# EAGLE schematic T01_Synth_Glove_v5_nsayre (EAGLE 7.1.0)
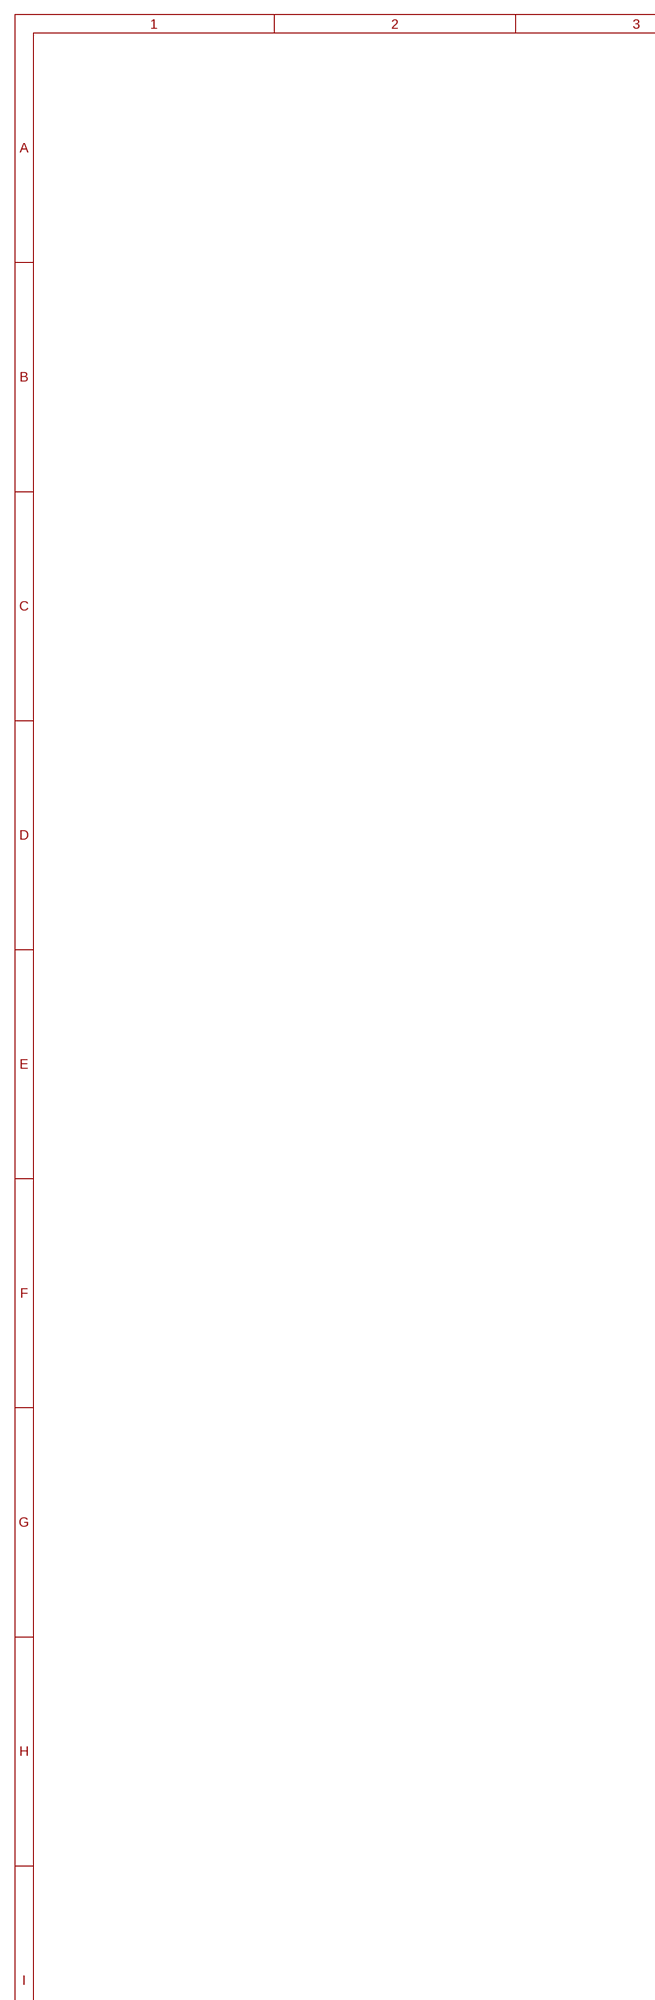
[diagram p0: schematic, sheet 1, part 1 of 2]
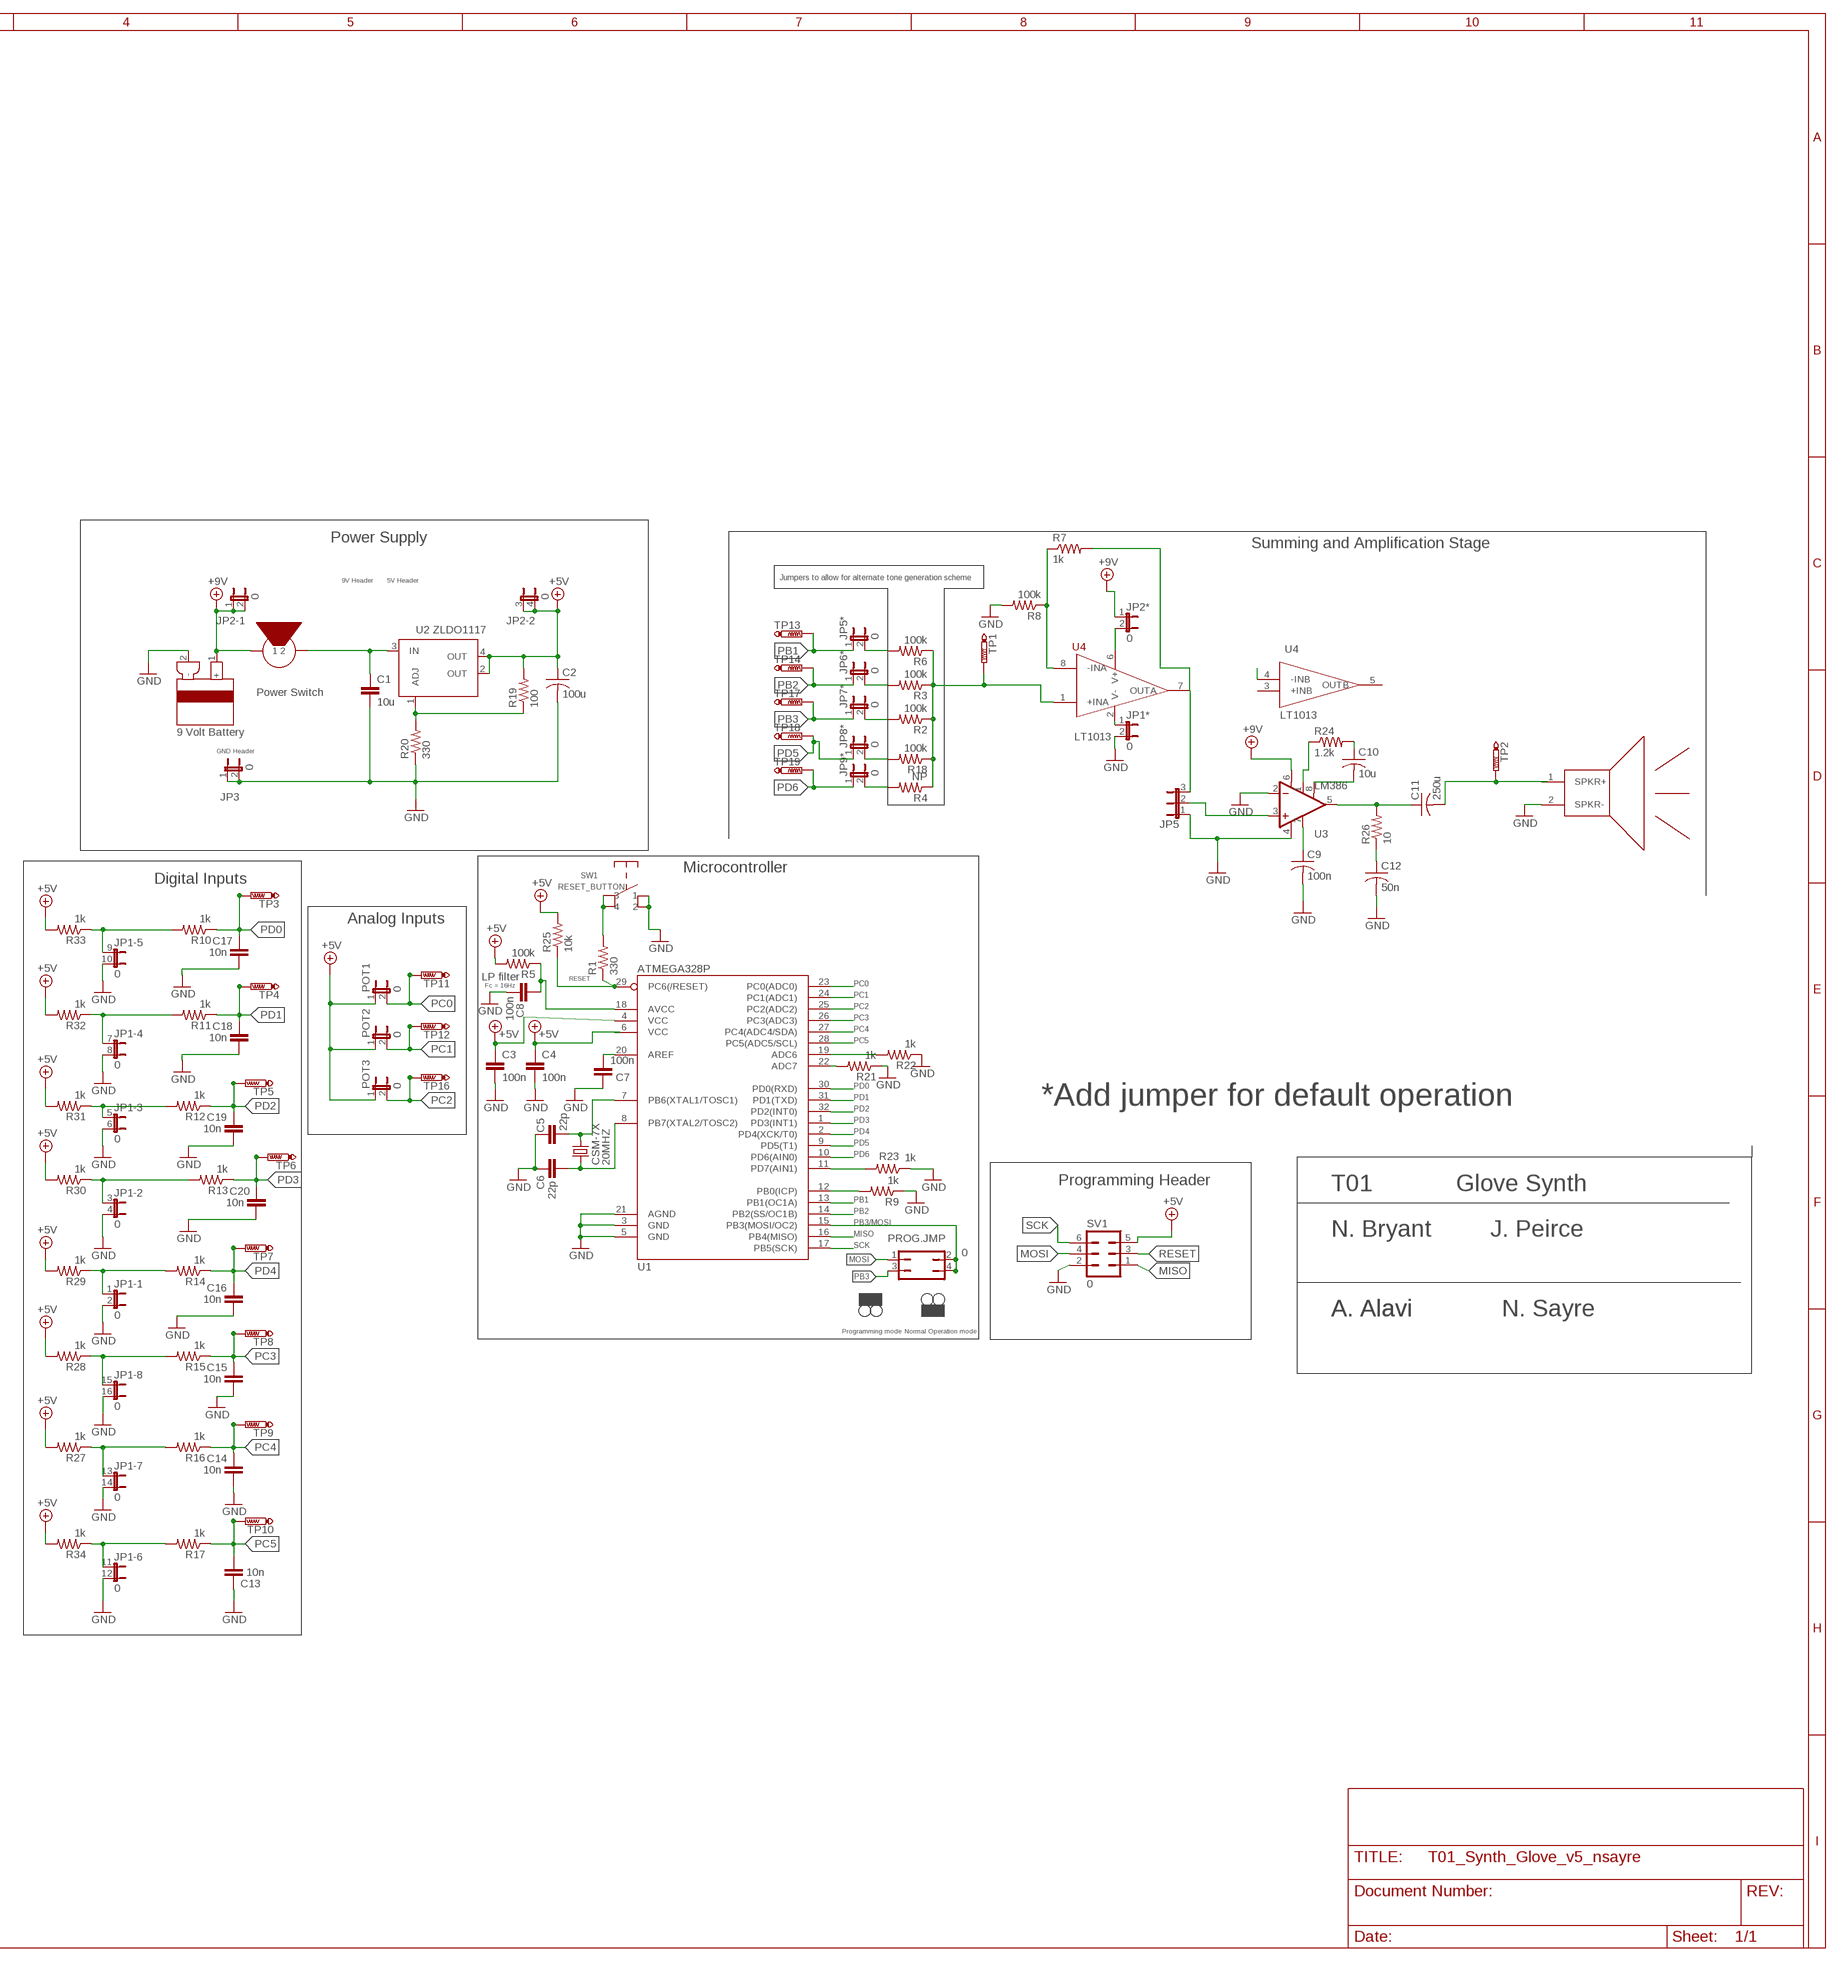
[diagram p1: schematic, sheet 1, part 2 of 2]

## Parts
20MHZ  CSM-7X  CSM-7X-DU  [CSM-7X-DU]
C1  10u  CAP0603-CAP  [0603-CAP]
C2  100u  C-US075-042X103  [C075-042X103]
C3  100n  CAP0603-CAP  [0603-CAP]
C4  100n  CAP0603-CAP  [0603-CAP]
C5  22p  CAP0603-CAP  [0603-CAP]
C6  22p  CAP0603-CAP  [0603-CAP]
C7  100n  CAP0603-CAP  [0603-CAP]
C8  100n  CAP0603-CAP  [0603-CAP]
C9  100n  C-US025-030X050  [C025-030X050]
C10  10u  C-US025-030X050  [C025-030X050]
C11  250u  C-US025-030X050  [C025-030X050]
C12  50n  C-US025-030X050  [C025-030X050]
C13  10n  CAP0603-CAP  [0603-CAP]
C14  10n  CAP0603-CAP  [0603-CAP]
C15  10n  CAP0603-CAP  [0603-CAP]
C16  10n  CAP0603-CAP  [0603-CAP]
C17  10n  CAP0603-CAP  [0603-CAP]
C18  10n  CAP0603-CAP  [0603-CAP]
C19  10n  CAP0603-CAP  [0603-CAP]
C20  10n  CAP0603-CAP  [0603-CAP]
JP1  0  JP8QE  [JP8Q]
JP1*  0  JP1E  [JP1]
JP2  0  JP2QE  [JP2Q]
JP2*  0  JP1E  [JP1]
JP3  0  JP1E  [JP1]
JP5  JP2E  [JP2]
JP5*  0  JP1E  [JP1]
JP6*  0  JP1E  [JP1]
JP7*  0  JP1E  [JP1]
JP8*  0  JP1E  [JP1]
JP9*  0  JP1E  [JP1]
POT1  0  JP1E  [JP1]
POT2  0  JP1E  [JP1]
POT3  0  JP1E  [JP1]
PROG.JMP  0  JP2Q  [JP2Q]
R1  330  RESISTOR0603  [0603-RES]
R2  100k  RESISTOR0603  [0603-RES]
R3  100k  RESISTOR0603  [0603-RES]
R4  NP  RESISTOR0603  [0603-RES]
R5  100k  RESISTOR0603  [0603-RES]
R6  100k  RESISTOR0603  [0603-RES]
R7  1k  RESISTOR0603  [0603-RES]
R8  100k  RESISTOR0603  [0603-RES]
R9  1k  RESISTOR0603  [0603-RES]
R10  1k  RESISTOR0603  [0603-RES]
R11  1k  RESISTOR0603  [0603-RES]
R12  1k  RESISTOR0603  [0603-RES]
R13  1k  RESISTOR0603  [0603-RES]
R14  1k  RESISTOR0603  [0603-RES]
R15  1k  RESISTOR0603  [0603-RES]
R16  1k  RESISTOR0603  [0603-RES]
R17  1k  RESISTOR0603  [0603-RES]
R18  100k  RESISTOR0603  [0603-RES]
R19  100  RESISTOR0603  [0603-RES]
R20  330  RESISTOR0603  [0603-RES]
R21  1k  RESISTOR0603  [0603-RES]
R22  1k  RESISTOR0603  [0603-RES]
R23  1k  RESISTOR0603  [0603-RES]
R24  1.2k  R-US_0204/2V  [0204V]
R25  10k  RESISTOR0603  [0603-RES]
R26  10  R-US_0204/2V  [0204V]
R27  1k  RESISTOR0603  [0603-RES]
R28  1k  RESISTOR0603  [0603-RES]
R29  1k  RESISTOR0603  [0603-RES]
R30  1k  RESISTOR0603  [0603-RES]
R31  1k  RESISTOR0603  [0603-RES]
R32  1k  RESISTOR0603  [0603-RES]
R33  1k  RESISTOR0603  [0603-RES]
R34  1k  RESISTOR0603  [0603-RES]
SV1  0  MA03-2  [MA03-2]
SW1  RESET_BUTTON  [RESET_BUTTON]
TP1  PTR1B2,54  [B2,54]
TP2  PTR1B2,54  [B2,54]
TP3  PTR1B2,54  [B2,54]
TP4  PTR1B2,54  [B2,54]
TP5  PTR1B2,54  [B2,54]
TP6  PTR1B2,54  [B2,54]
TP7  PTR1B2,54  [B2,54]
TP8  PTR1B2,54  [B2,54]
TP9  PTR1B2,54  [B2,54]
TP10  PTR1B2,54  [B2,54]
TP11  PTR1B2,54  [B2,54]
TP12  PTR1B2,54  [B2,54]
TP13  PTR1B2,54  [B2,54]
TP14  PTR1B2,54  [B2,54]
TP16  PTR1B2,54  [B2,54]
TP17  PTR1B2,54  [B2,54]
TP18  PTR1B2,54  [B2,54]
TP19  PTR1B2,54  [B2,54]
U1  ATMEGA328P  ATMEGA328_SMT  [TQFP32-08]
U2  ZLDO1117  [SOT223]
U3  LM386  [DIP08]
U4  LT1013  [SO08]
U$1  SPEAKER  [JP1]
U$7  POWER_SWITCH  [JP1]
U$8  9VOLTBATTERY  [JP1]

## Nets
+5V: C2.1 C3.1 C4.1 JP2.3 JP2.4 POT1.1 POT2.1 POT3.1 R5.2 R19.2 R25.2 R27.2 R28.2 R29.2 R30.2 R31.2 R32.2 R33.2 R34.2 SV1.5 U1.4(VCC) U2.2(OUT) U2.4(OUT)
+9V: JP2*.1 JP2.1 JP2.2 U3.6(V+) U$7.1 U$8.1(+)
GND: C1.2 C2.2 C3.2 C4.2 C5.2 C6.2 C7.2 C8.2 C9.2 C12.2 C13.2 C14.1 C15.1 C16.1 C17.1 C18.1 C19.1 C20.1 JP1*.2 JP1.2 JP1.4 JP1.6 JP1.8 JP1.10 JP1.12 JP1.14 JP1.16 JP3.1 JP3.2 JP5.1 R8.2 R9.1 R20.1 R21.1 R22.1 R23.1 SV1.2 SW1.1 SW1.2 U1.3(GND) U1.5(GND) U1.21(AGND) U3.2(-IN) U3.4(V-) U$1.2(SPKR-) U$8.2(-)
MISO: SV1.1 U1.16(PB4(MISO))
MOSI: PROG.JMP.1 SV1.4
N$1: C7.1 U1.20(AREF)
N$2: R2.1 R3.1 R4.1 R6.1 R18.1 TP1.TP U4.1(+INA)
N$3: JP1.9 R10.2 R33.1
N$4: JP1.7 R11.2 R32.1
N$5: JP1.5 R12.2 R31.1
N$6: 20MHZ.1 C5.1 U1.7(PB6(XTAL1/TOSC1))
N$7: 20MHZ.2 C6.1 U1.8(PB7(XTAL2/TOSC2))
N$8: C8.1 R5.1 U1.18(AVCC)
N$9: R21.2 U1.22(ADC7)
N$10: R22.2 U1.19(ADC6)
N$11: JP1.3 R13.2 R30.1
N$12: JP1.1 R14.2 R29.1
N$15: JP1.13 R16.2 R27.1
N$16: R7.1 R8.1 U4.8(-INA)
N$17: R9.2 U1.12(PB0(ICP))
N$18: JP5*.2 R6.2
N$21: JP9*.2 R4.2
N$22: R1.2 SW1.3 SW1.4
N$23: JP1.11 R17.2 R34.1
N$25: JP8*.2 R18.2
N$26: U4.4(-INB)
N$27: C10.1 R24.2
N$31: C11.2 TP2.TP
N$32: JP7*.2 R2.2
N$34: JP2*.2 U4.6(V+)
N$35: R7.2 U4.7(OUTA)
N$36: JP5.3
N$37: R19.1 R20.2 U2.1(ADJ)
N$38: C1.1 U2.3(IN) U$7.2
N$39: JP6*.2 R3.2
N$40: R24.1 U3.1(GAIN)
N$41: C10.2 U3.8(GAIN)
N$42: JP1.15 R15.2 R28.1
N$44: JP5.2 U3.3(+IN)
N$47: C9.1 U3.7(BP)
N$49: C11.1 R26.2 U3.5(OUT)
N$50: C12.1 R26.1
PB1: JP5*.1 TP13.TP U1.13(PB1(OC1A))
PB2: JP6*.1 TP14.TP U1.14(PB2(SS/OC1B))
PB3: JP7*.1 PROG.JMP.3 TP17.TP
PB3/MOSI: PROG.JMP.2 PROG.JMP.4 U1.15(PB3(MOSI/OC2))
PC0: POT1.2 TP11.TP U1.23(PC0(ADC0))
PC1: POT2.2 TP12.TP U1.24(PC1(ADC1))
PC2: POT3.2 TP16.TP U1.25(PC2(ADC2))
PC3: C15.2 R15.1 TP8.TP U1.26(PC3(ADC3))
PC4: C14.2 R16.1 TP9.TP U1.27(PC4(ADC4/SDA))
PC5: C13.1 R17.1 TP10.TP U1.28(PC5(ADC5/SCL))
PD0: C17.2 R10.1 TP3.TP U1.30(PD0(RXD))
PD1: C18.2 R11.1 TP4.TP U1.31(PD1(TXD))
PD2: C19.2 R12.1 TP5.TP U1.32(PD2(INT0))
PD3: C20.2 R13.1 TP6.TP U1.1(PD3(INT1))
PD4: C16.2 R14.1 TP7.TP U1.2(PD4(XCK/T0))
PD5: JP8*.1 TP18.TP U1.9(PD5(T1))
PD6: JP9*.1 TP19.TP U1.10(PD6(AIN0))
PD7: R23.2 U1.11(PD7(AIN1))
RESET: R1.1 R25.1 SV1.3 U1.29(PC6(/RESET))
SCK: SV1.6 U1.17(PB5(SCK))
V-: JP1*.1 U4.2(V-)
Unconnected: U1.6(VCC) U4.3(+INB) U4.5(OUTB) U$1.1(SPKR+)

## Notes on the sheet
- Power Supply
- Summing and Amplification Stage
- Jumpers to allow for alternate tone generation scheme
- 9V Header | 5V Header
- Power Switch
- GND Header
- Microcontroller
- Digital Inputs
- Analog Inputs
- LP filter
- Fc = 16Hz
- *Add jumper for default operation
- Programming Header
- T01 | Glove Synth
- N. Bryant | J. Peirce
- A. Alavi | A. Alavi | N. Sayre
- Programming mode | Normal Operation mode

## Library data of the parts
20MHZ = crystal:CSM-7X-DU: SMD CRYSTAL Source: www.ecsxtal.com .. Crystal 3.6864MHz CSM_7X_DU.PDF; OC_FARNELL: unknown; OC_NEWARK: unknown
C1 C3-C8 C13-C20 = SparkFun-Capacitors:CAP: Capacitor Standard 0603 ceramic capacitor, and 0.1" leaded capacitor.
C2 C9-C12 = adafruit:C-US: CAPACITOR, American symbol
JP1 = jumper:JP8QE: JUMPER
JP1* JP2* JP3 JP5* JP6* JP7* JP8* JP9* POT1-POT3 = jumper:JP1E: JUMPER
JP2 = jumper:JP2QE: JUMPER
JP5 = jumper:JP2E: JUMPER
PROG.JMP = jumper:JP2Q: JUMPER
R1-R23 R25 R27-R34 = SparkFun-Resistors:RESISTOR: Resistor Basic schematic elements and footprints for 0603, 1206, and PTH resistors.
R24 R26 = adafruit:R-US_: RESISTOR, American symbol
SV1 = con-lstb:MA03-2: PIN HEADER; OC_FARNELL: unknown; OC_NEWARK: unknown
SW1 = Synth_Glove:RESET_BUTTON
TP1-TP14 TP16-TP19 = testpad:PTR1: TEST PIN
U1 = SparkFun-DigitalIC:ATMEGA328_SMT: 32-Pin Atmega328 part Commonly used on Arduino compatible boards Available in QFP and QFN packages TQFP is IC-09069 QFN is non-stock; PROD_ID: IC-09069
U2 = Synth_Glove:ZLDO1117
U3 = SparkFun-AnalogIC:LM386: low voltage audio power amplifier
U4 = Synth_Glove:LT1013: Linear Technology dual input precision op amps
U$1 = Synth_Glove:SPEAKER
U$7 = Synth_Glove:POWER_SWITCH
U$8 = Synth_Glove:9VOLTBATTERY